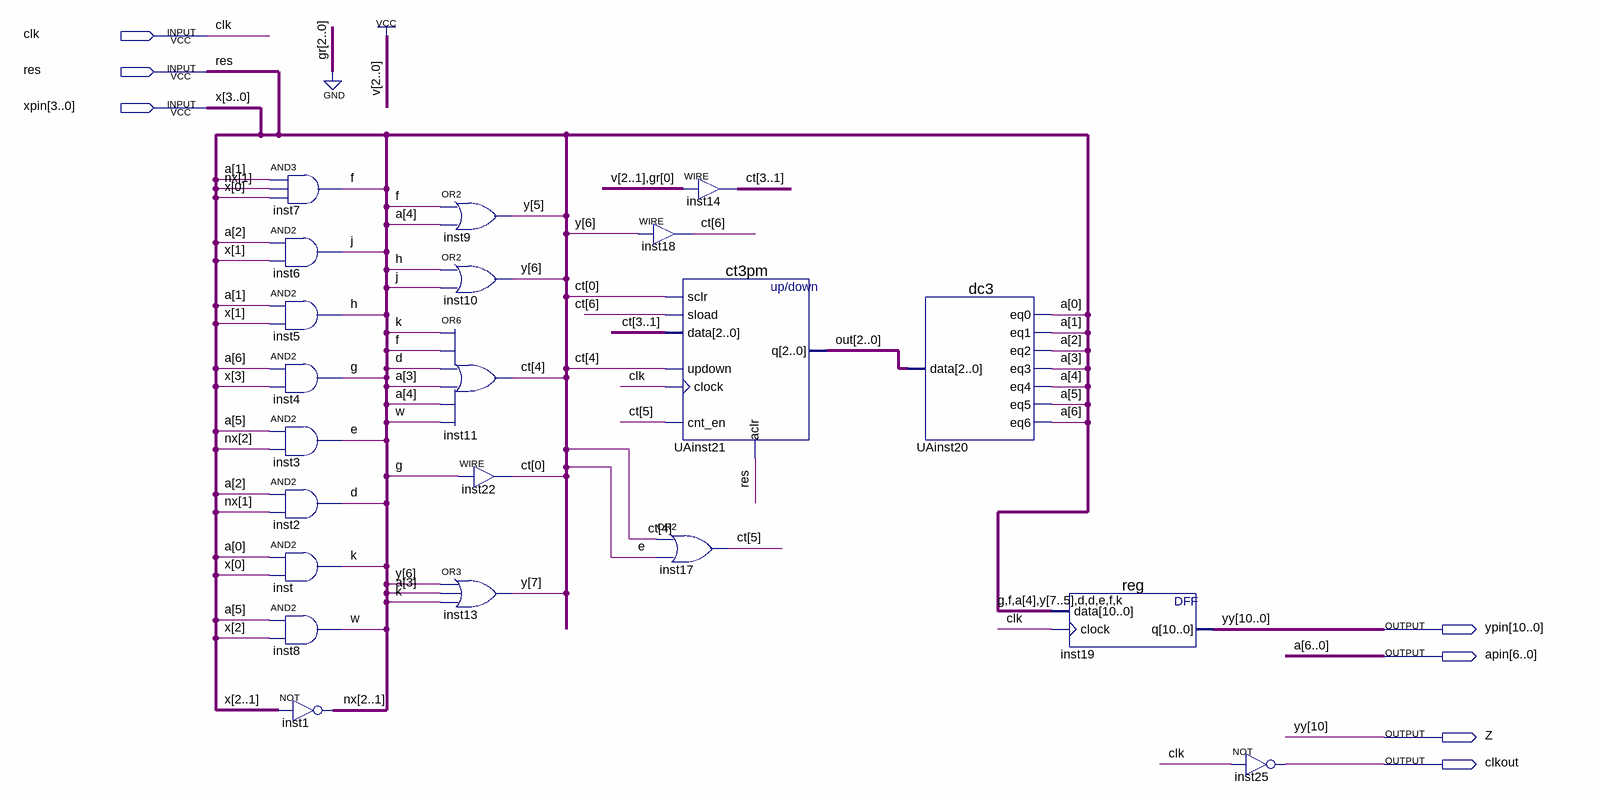
[diagram p0: schematic sheet]
// Quartus schematic UA.bdf as structural Verilog: 21 symbols, 7 pins
module UA (
  input  clk,
  input  res,
  input  [3:0] xpin,
  output [10:0] ypin,
  output [6:0] apin,
  output Z,
  output clkout
);

  wire d, e, f, g, h, j, k, w;
  wire [2:0] out;
  wire [2:1] nx;
  wire [6:0] ct;
  wire [7:5] y;

  and inst7 (f, apin[1], nx[1], xpin[0]);
  and inst6 (j, apin[2], xpin[1]);
  and inst5 (h, apin[1], xpin[1]);
  and inst4 (g, apin[6], xpin[3]);
  and inst3 (e, apin[5], nx[2]);
  and inst2 (d, apin[2], nx[1]);
  and inst (k, apin[0], xpin[0]);
  and inst8 (w, apin[5], xpin[2]);
  assign nx = ~xpin[2:1];  // NOT inst1, 2 bits wide
  or inst9 (y[5], f, apin[4]);
  or inst10 (y[6], h, j);
  or inst11 (ct[4], k, f, d, apin[3], apin[4], w);
  assign ct[0] = g;  // WIRE inst22
  or inst13 (y[7], y[6], apin[3], k);
  assign ct[3:1] = 3'b110;  // WIRE inst14
  assign ct[6] = y[6];  // WIRE inst18
  ct3pm UAinst21 (
    .sclr(ct[0]), .sload(ct[6]), .data(ct[3:1]), .updown(ct[4]), .clock(clk), .cnt_en(ct[5]), .aclr(res),
    .q(out));
  or inst17 (ct[5], ct[4], e);
  dc3 UAinst20 (
    .data(out), .eq0(apin[0]), .eq1(apin[1]), .eq2(apin[2]), .eq3(apin[3]), .eq4(apin[4]), .eq5(apin[5]),
    .eq6(apin[6]));
  \reg  inst19 (.data({g, f, apin[4], y, {2{d}}, e, f, k}), .clock(clk), .q(ypin));
  not inst25 (clkout, clk);

  assign Z = ypin[10];

  // Other names for the same wires on the sheet: a[6:0] = apin; x[3:0] = xpin; yy[10:0] = ypin
endmodule
